# Altium schematic sheet VoedingSCH.SchDoc: Voeding schema
size A4; DrawnBy: Nino Bleus; Engineer: Nino Bleus; Revision: 1.0.0; SheetNumber: 1; SheetTotal: 4; number: 1EAI-20200001
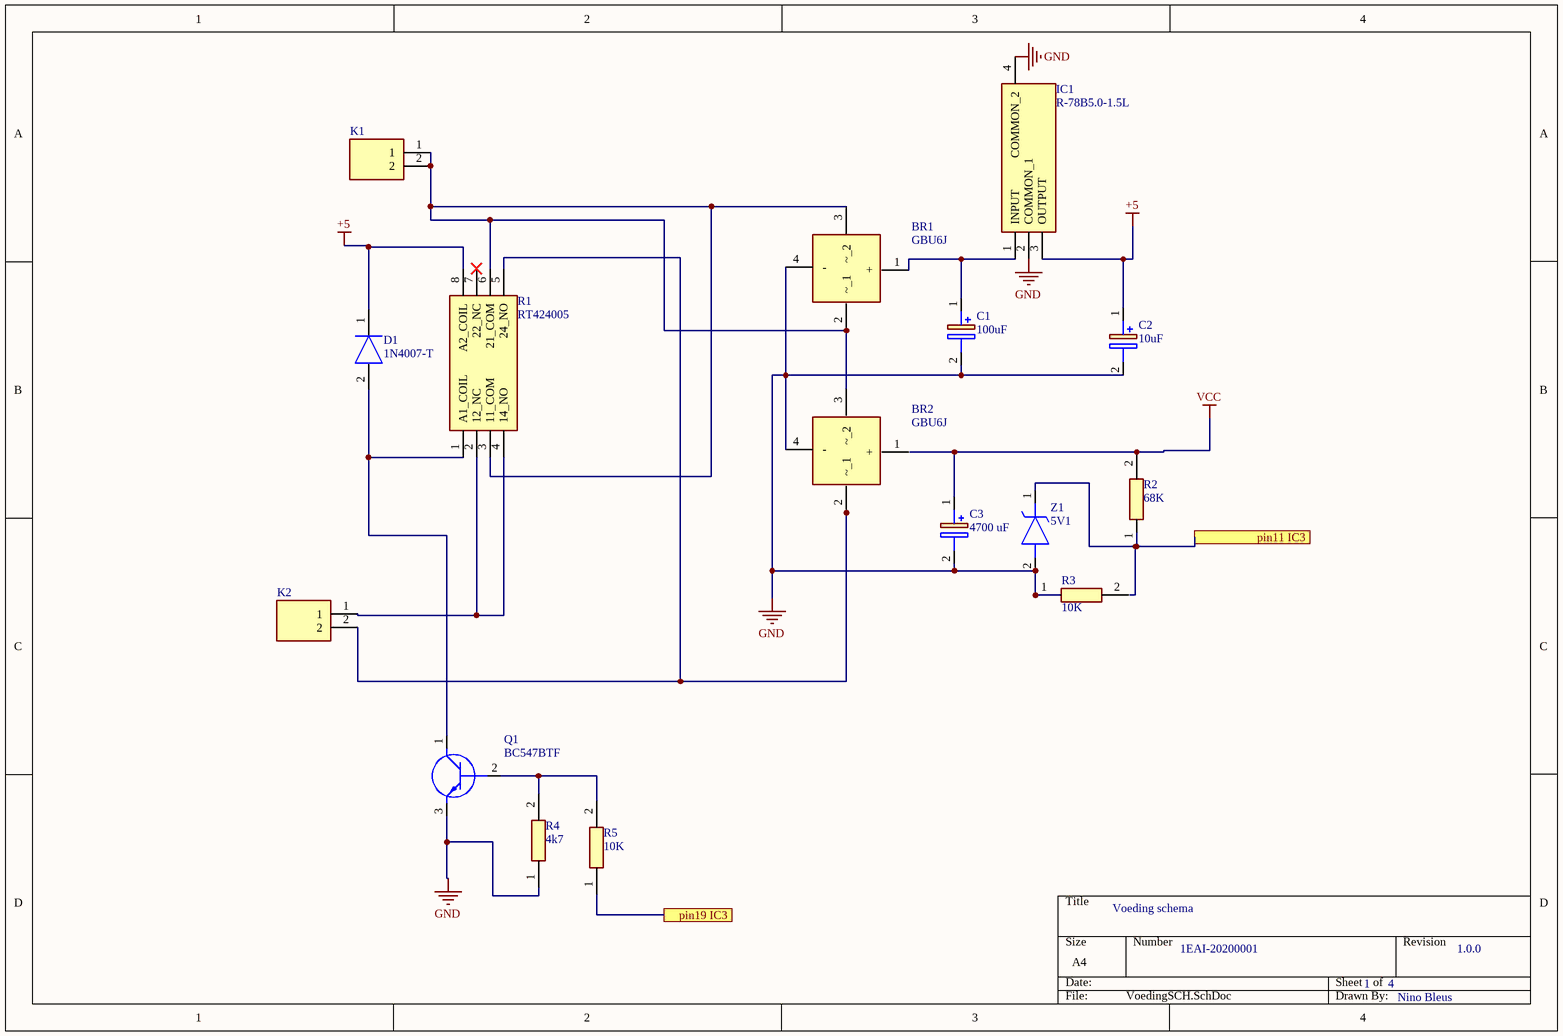
[diagram p0: VoedingSCH.SchDoc]

## Parts
BR1  GBU6J  [GBU6J]
BR2  GBU6J  [GBU6J]
C1  100uF  [CAPPRD350W60D800H1250]
C2  10uF  [CAPPRD250W45D630H850]
C3  4700 uF  [CAPPRD1000W80D2200H3700]
D1  1N4007-T  [DIOAD1408W86L464D236]
IC1  R-78B5.0-1.5L  [TL78005CKTTR]
K1  printkroonconnector  [1729128]  (value not drawn)
K2  printkroonconnector  [1729128]  (value not drawn)
Q1  BC547BTF  [BC33740TA]
R1  RT424005  [RT42]
R2  68K  [RESC2012X65N]
R3  10K  [RESC2012X65N]
R4  4k7  [RESC2012X65N]
R5  10K  [RESC2012X65N]
Z1  5V1  [DIOAD1068W53L380D172]

## Ports
pin11 IC3, pin19 IC3

## Nets
+5: C2.1(+) D1.1(K) IC1.3(OUTPUT) R1.8(A2_COIL)
GND: BR1.4(-) BR2.4(-) C1.2(-) C2.2(-) C3.2(-) IC1.2(COMMON_1) IC1.4(COMMON_2) Q1.3(E) R3.1 R4.1 Z1.2(A)
VCC: C3.1(+) R2.2
pin11 IC3: R2.1 Z1.1(K) ; port pin11 IC3
pin19 IC3: R5.1 ; port pin19 IC3
NetBR1_1: BR1.1(+) C1.1(+) IC1.1(INPUT)
NetBR1_2: BR1.2(~_1) BR1.3(~_2) BR2.3(~_2) K1.1 K1.2 R1.3(11_COM) R1.6(21_COM)
NetBR2_2: BR2.2(~_1) K2.2 R1.5(24_NO)
NetD1_2: D1.2(A) Q1.1(C) R1.1(A1_COIL)
NetK2_1: K2.1 R1.2(12_NC) R1.4(14_NO)
NetQ1_2: Q1.2(B) R4.2 R5.2

Not connected (* = marked no-connect by the designer): BR2 1(+); R1 7(22_NC)*; R3 2

## Library data of the parts
BR1 BR2 = GBU6J: Bridge Rectifier; Manufacturer_Name: GeneSiC Semiconductor; Datasheet Link: https://www.diodemodule.com/silicon_products/bridge_rectifiers/gbu6j.pdf; Height: 18.8mm; Manufacturer_Part_Number: GBU6J
C1 = ESK107M050AG3EA: Capacitor Polarised; Manufacturer_Name: Kemet; Height: 12.5mm; Manufacturer_Part_Number: ESK107M050AG3EA
C2 = 10uF Capaciteit: Capacitor Polarised; Manufacturer_Name: Kemet; Manufacturer_Part_Number: ESS106M050AE2AA; Datasheet Link: https://content.kemet.com/datasheets/KEM_A4057_ESS.pdf; Height: 8.5mm
C3 = 4700 uF capaciteit: Capacitor Polarised; Manufacturer_Name: Kemet; Manufacturer_Part_Number: ESK478M050AQ3AA; Datasheet Link: https://componentsearchengine.com//ESK478M050AQ3AA.pdf; Height: 37mm; Mouser2 Part Number: 80-ESK478M050AQ3AA; Mouser2 Price/Stock: https://www.mouser.com/Search/Refine.aspx?Keyword=80-ESK478M050AQ3AA
D1 = 1N4007-T: Diode; Manufacturer_Name: Rectron; Datasheet Link: https://componentsearchengine.com//1N4007-T.pdf; Mouser2 Part Number: 583-1N4007-T; Mouser2 Price/Stock: https://www.mouser.com/Search/Refine.aspx?Keyword=583-1N4007-T; Manufacturer_Part_Number: 1N4007-T
IC1 = TL780-05CKTTR: Integrated Circuit; Manufacturer_Name: Texas Instruments; Datasheet Link: http://www.ti.com/general/docs/suppproductinfo.tsp?distId=26&gotoUrl=http%3A%2F%2Fwww.ti.com%2Flit%2Fgpn%2Ftl780; Height: 5.08mm; Manufacturer_Part_Number: TL780-05CKTTR
K1 K2 = printkroonconnector: Connector; Manufacturer_Name: Phoenix Contact; Datasheet Link: http://www.phoenixcontact.com/de/produkte/1729128/pdf; Height: 10.15mm; Manufacturer_Part_Number: 1729128
Q1 = BC547BTF: Transistor BJT NPN; Manufacturer_Name: ON Semiconductor; Datasheet Link: https://www.onsemi.com/pub/Collateral/BC550-D.pdf; Manufacturer_Part_Number: BC547BTF
R1 = RT424005: Relay or Contactor; Manufacturer_Name: TE Connectivity; Datasheet Link: https://componentsearchengine.com//RT424005.pdf; Mouser2 Part Number: 655-RT424005; Mouser2 Price/Stock: https://www.mouser.com/Search/Refine.aspx?Keyword=655-RT424005; Manufacturer_Part_Number: RT424005
R2-R5 = ESR10EZPJ183: Resistor; Manufacturer_Name: ROHM Semiconductor; Datasheet Link: https://datasheet.datasheetarchive.com/originals/distributors/Datasheets_SAMA/30ccb516c688c96e56c83a00b77a93f4.pdf; Height: 0.65mm; Manufacturer_Part_Number: ESR10EZPJ183
Z1 = 1N5231B: Zener Diode; Manufacturer_Name: ON Semiconductor; Manufacturer_Part_Number: 1N5231B